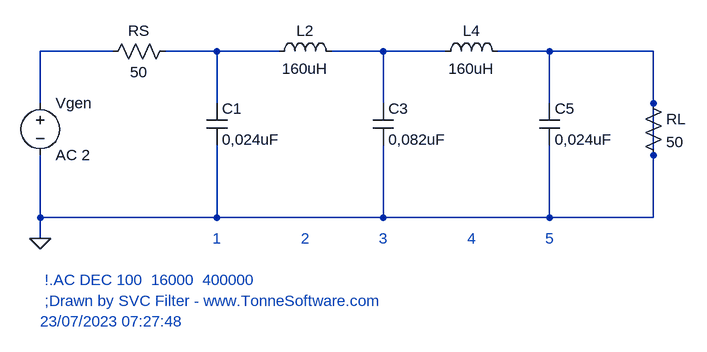
[diagram p0: schematic passe-bas-80kHz.asc]
passe-bas-80kHz.asc, the LTspice schematic file:
Version 4
SHEET 1  976  600
SYMBOL voltage  0  144 R0
WINDOW 123 24 132 Left 0
SYMATTR InstName Vgen
SYMATTR Value AC 2
SYMBOL res 208  64 R90
WINDOW 0 0 56 Vbottom 0
WINDOW 3 32 56 Vtop 0
SYMATTR InstName RS
SYMATTR Value 50 
WIRE  0  160  0  80 
WIRE  0  80  112  80 
WIRE  192  80  224  80 
WIRE  0  240  0  336 
WIRE  0  336  224  336 
WIRE  0  336  0  368 
FLAG  0  368 0
TEXT 0 432 Left 0  !.AC DEC 100  16000  400000 
TEXT 0 464 Left 0  ;Drawn by SVC Filter - www.TonneSoftware.com
TEXT 0 496 Left 0 23/07/2023 07:27:48 
SYMBOL cap  256  160 R0
SYMATTR InstName C1
SYMATTR Value 0,024uF
WIRE  224  80  336  80 
WIRE  272  80  272  160 
WIRE  272  224  272  336 
WIRE  224  336  336  336 
TEXT  272 368 Center 0 ; 1 
SYMBOL ind  352  96 R270
WINDOW 0 32 56 Vtop 0
WINDOW 3 5 56 Vbottom 0
SYMATTR InstName L2
SYMATTR Value 160uH
SYMATTR SpiceLine Rser=8,042477E-05
WIRE  336  80  368  80 
WIRE  448  80  480  80 
WIRE  336  336  480  336 
TEXT  408 368 Center 0 ; 2 
SYMBOL cap  512  160 R0
SYMATTR InstName C3
SYMATTR Value 0,082uF
WIRE  480  80  592  80 
WIRE  528  80  528  160 
WIRE  528  224  528  336 
WIRE  480  336  592  336 
TEXT  528 368 Center 0 ; 3 
SYMBOL ind  608  96 R270
WINDOW 0 32 56 Vtop 0
WINDOW 3 5 56 Vbottom 0
SYMATTR InstName L4
SYMATTR Value 160uH
SYMATTR SpiceLine Rser=8,042477E-05
WIRE  592  80  624  80 
WIRE  704  80  736  80 
WIRE  592  336  736  336 
TEXT  664 368 Center 0 ; 4 
SYMBOL cap  768  160 R0
SYMATTR InstName C5
SYMATTR Value 0,024uF
WIRE  736  80  848  80 
WIRE  784  80  784  160 
WIRE  784  224  784  336 
WIRE  736  336  848  336 
TEXT  784 368 Center 0 ; 5 
SYMBOL res  928  144 R0
SYMATTR InstName RL
SYMATTR Value 50 
WIRE  848  80  944  80 
WIRE  944  80  944  160 
WIRE  848  336  944  336 
WIRE  944  336  944  160

The netlist it stands for:
* passe-bas-80kHz.asc
Vgen N001 0 AC 2
RS N002 N001 50
C1 N002 0 0,024uF
L2 N002 N003 160uH Rser=8,042477E-05
C3 N003 0 0,082uF
L4 N003 0 160uH Rser=8,042477E-05
C5 0 0 0,024uF
RL 0 0 50
*  !.AC DEC 100  16000  400000
*  ;Drawn by SVC Filter - www.TonneSoftware.com
* 23/07/2023 07:27:48
*  1
*  2
*  3
*  4
*  5
.backanno
.end